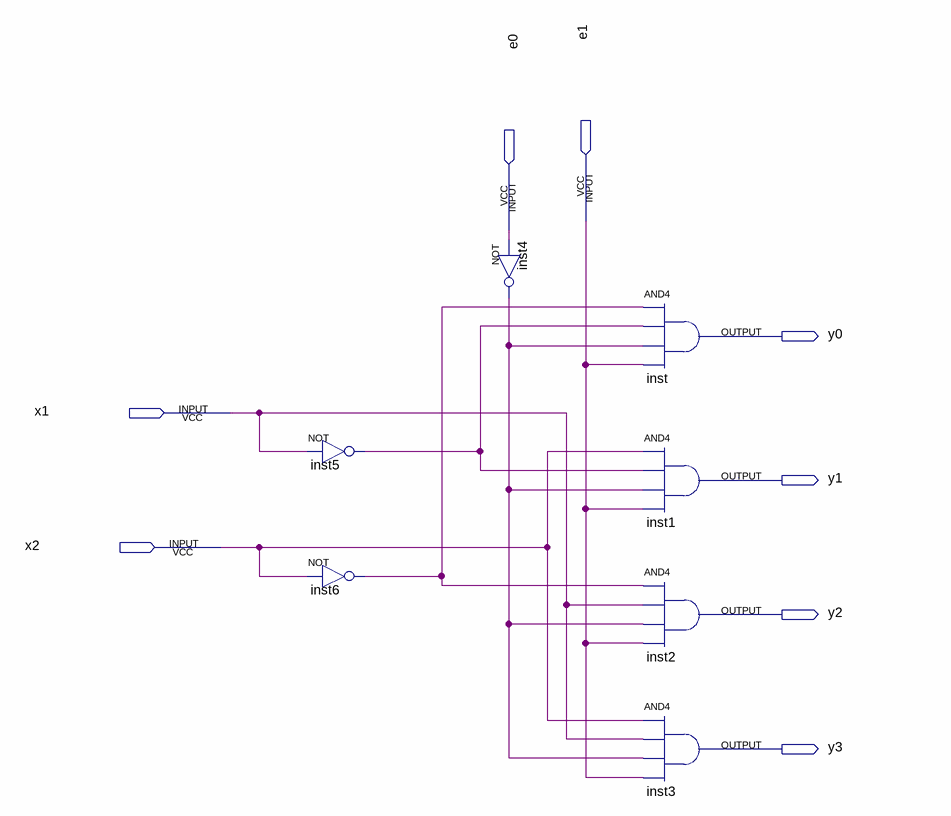
[diagram p0: schematic sheet]
// Quartus schematic dec2_4.bdf as structural Verilog: 7 symbols, 8 pins
module dec2_4 (
  input  e1,
  input  e0,
  input  x1,
  input  x2,
  output y0,
  output y1,
  output y2,
  output y3
);

  wire inst4_out, inst5_out, inst6_out;

  not inst5 (inst5_out, x1);
  not inst6 (inst6_out, x2);
  not inst4 (inst4_out, e0);
  and inst (y0, inst6_out, inst5_out, inst4_out, e1);
  and inst1 (y1, x2, inst5_out, inst4_out, e1);
  and inst2 (y2, inst6_out, x1, inst4_out, e1);
  and inst3 (y3, x2, x1, inst4_out, e1);
endmodule
